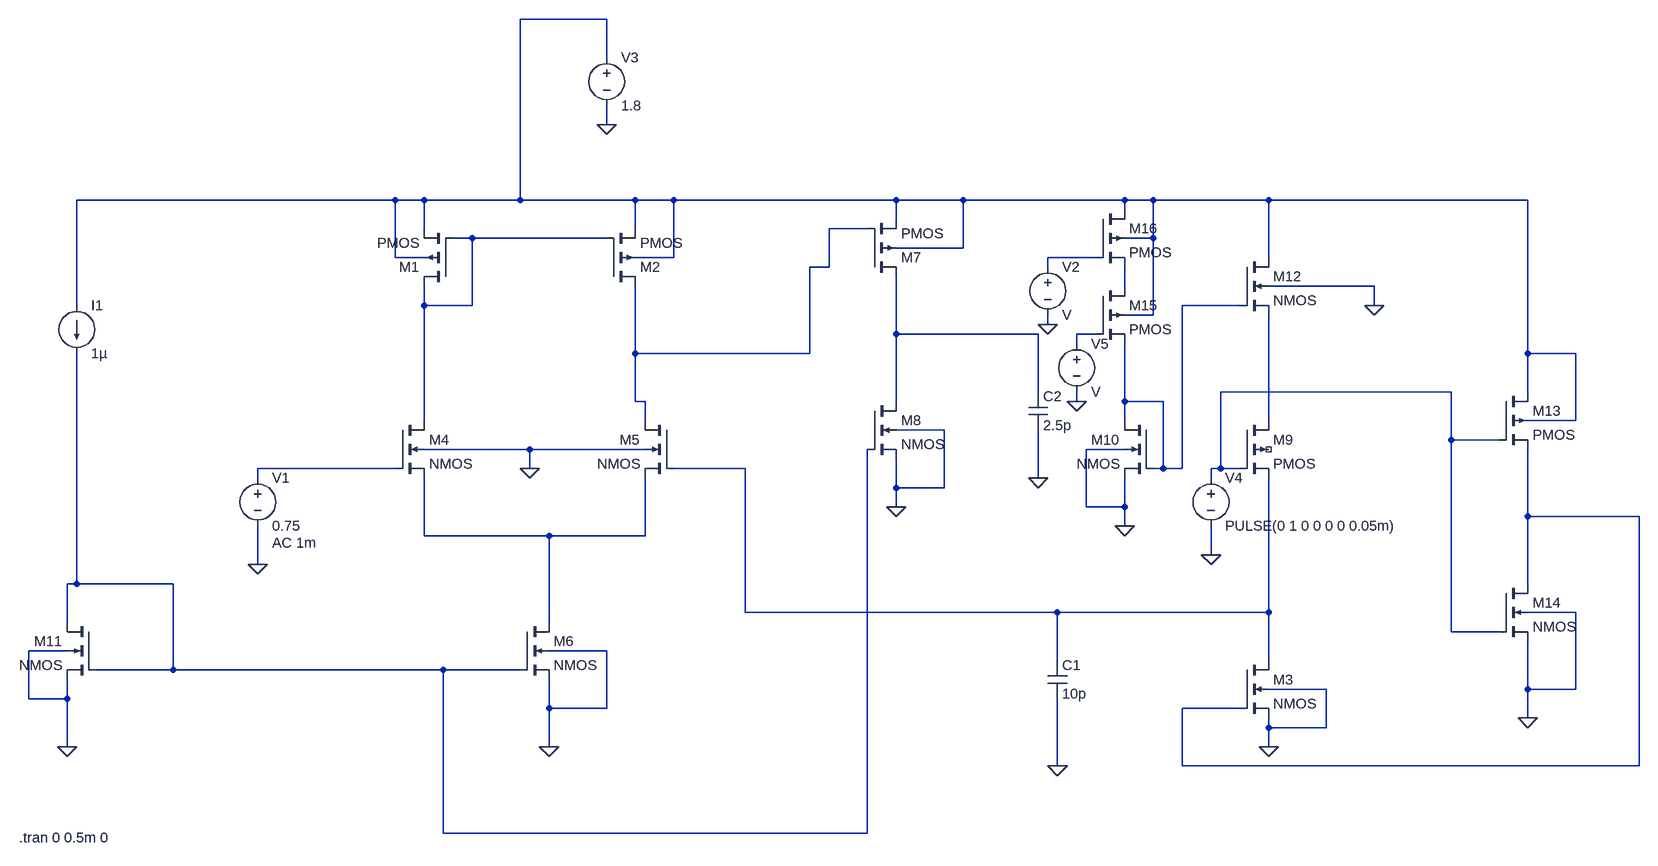
[diagram p0: schematic comp.asc]
comp.asc, the LTspice schematic file:
Version 4
SHEET 1 3156 680
WIRE 1088 -768 944 -768
WIRE 1088 -704 1088 -768
WIRE 1088 -592 1088 -624
WIRE 496 -400 -400 -400
WIRE 736 -400 496 -400
WIRE 784 -400 736 -400
WIRE 944 -400 944 -768
WIRE 944 -400 784 -400
WIRE 1136 -400 944 -400
WIRE 1200 -400 1136 -400
WIRE 1360 -400 1200 -400
WIRE 1664 -400 1360 -400
WIRE 1776 -400 1664 -400
WIRE 2048 -400 1776 -400
WIRE 2096 -400 2048 -400
WIRE 2288 -400 2096 -400
WIRE 2720 -400 2288 -400
WIRE 2048 -384 2048 -400
WIRE 1664 -368 1664 -400
WIRE 784 -352 784 -400
WIRE 1136 -352 1136 -400
WIRE 1616 -352 1552 -352
WIRE 864 -336 832 -336
WIRE 1024 -336 864 -336
WIRE 1088 -336 1024 -336
WIRE 2096 -336 2096 -400
WIRE 2096 -336 2048 -336
WIRE 1776 -320 1776 -400
WIRE 1776 -320 1664 -320
WIRE 736 -304 736 -400
WIRE 784 -304 736 -304
WIRE 1200 -304 1200 -400
WIRE 1200 -304 1136 -304
WIRE 2000 -304 1920 -304
WIRE 2288 -304 2288 -400
WIRE 1552 -288 1552 -352
WIRE 1552 -288 1520 -288
WIRE 1920 -288 1920 -304
WIRE 2048 -256 2048 -288
WIRE 2464 -256 2288 -256
WIRE -400 -224 -400 -400
WIRE 784 -224 784 -256
WIRE 864 -224 864 -336
WIRE 864 -224 784 -224
WIRE 2240 -224 2144 -224
WIRE 2464 -224 2464 -256
WIRE 1664 -208 1664 -272
WIRE 2096 -208 2096 -336
WIRE 2096 -208 2048 -208
WIRE 2720 -208 2720 -400
WIRE 1136 -192 1136 -256
WIRE 1920 -192 1920 -208
WIRE 1664 -176 1664 -208
WIRE 1904 -176 1664 -176
WIRE 2000 -176 1968 -176
WIRE 1968 -160 1968 -176
WIRE 1136 -144 1136 -192
WIRE 1312 -144 1136 -144
WIRE 1520 -144 1520 -288
WIRE 1520 -144 1312 -144
WIRE 2720 -144 2720 -208
WIRE 2800 -144 2720 -144
WIRE 784 -96 784 -224
WIRE 2144 -96 2144 -224
WIRE 1904 -80 1904 -176
WIRE 2400 -80 2208 -80
WIRE 2592 -80 2400 -80
WIRE 2720 -80 2720 -144
WIRE 1136 -64 1136 -144
WIRE 1152 -64 1136 -64
WIRE 1664 -64 1664 -176
WIRE 1968 -64 1968 -80
WIRE 2048 -64 2048 -160
WIRE 2112 -64 2048 -64
WIRE 784 -32 784 -96
WIRE 1152 -32 1152 -64
WIRE 2048 -32 2048 -64
WIRE 2288 -32 2288 -208
WIRE 2800 -32 2800 -144
WIRE 2800 -32 2720 -32
WIRE 1744 -16 1664 -16
WIRE 2592 0 2592 -80
WIRE 2672 0 2592 0
WIRE 960 16 784 16
WIRE 1152 16 960 16
WIRE 2048 16 1984 16
WIRE 736 48 480 48
WIRE 960 48 960 16
WIRE 1360 48 1200 48
WIRE 1376 48 1360 48
WIRE 2112 48 2112 -64
WIRE 2112 48 2096 48
WIRE 2144 48 2144 -96
WIRE 2144 48 2112 48
WIRE 2208 48 2208 -80
WIRE 2208 48 2192 48
WIRE 2240 48 2208 48
WIRE 480 64 480 48
WIRE 1904 64 1904 -16
WIRE 2192 64 2192 48
WIRE 1664 80 1664 32
WIRE 1744 80 1744 -16
WIRE 1744 80 1664 80
WIRE 1664 112 1664 80
WIRE 1984 112 1984 16
WIRE 2048 112 2048 64
WIRE 2048 112 1984 112
WIRE 2720 128 2720 16
WIRE 2784 128 2720 128
WIRE 3152 128 2784 128
WIRE 2048 144 2048 112
WIRE 784 160 784 64
WIRE 880 160 784 160
WIRE 992 160 880 160
WIRE 1152 160 1152 64
WIRE 1152 160 992 160
WIRE 2192 192 2192 144
WIRE 480 208 480 144
WIRE 1616 224 1616 16
WIRE -400 240 -400 -144
WIRE -400 240 -416 240
WIRE -224 240 -400 240
WIRE 2720 240 2720 128
WIRE 1376 288 1376 48
WIRE 1776 288 1376 288
WIRE 1936 288 1776 288
WIRE 2112 288 1936 288
WIRE 2288 288 2288 64
WIRE 2288 288 2112 288
WIRE 2800 288 2720 288
WIRE -416 304 -416 240
WIRE 992 304 992 160
WIRE 2592 320 2592 0
WIRE 2672 320 2592 320
WIRE -416 352 -480 352
WIRE 1088 352 992 352
WIRE 1936 368 1936 288
WIRE 2288 368 2288 288
WIRE -224 384 -224 240
WIRE -224 384 -368 384
WIRE 816 384 -224 384
WIRE 944 384 816 384
WIRE 2384 416 2288 416
WIRE 2720 416 2720 336
WIRE 2800 416 2800 288
WIRE 2800 416 2720 416
WIRE -480 432 -480 352
WIRE -416 432 -416 400
WIRE -416 432 -480 432
WIRE 992 448 992 400
WIRE 1088 448 1088 352
WIRE 1088 448 992 448
WIRE 2240 448 2144 448
WIRE 2720 464 2720 416
WIRE 2288 480 2288 464
WIRE 2384 480 2384 416
WIRE 2384 480 2288 480
WIRE -416 512 -416 432
WIRE 992 512 992 448
WIRE 2288 512 2288 480
WIRE 1936 544 1936 432
WIRE 2144 544 2144 448
WIRE 3152 544 3152 128
WIRE 3152 544 2144 544
WIRE 816 656 816 384
WIRE 1616 656 1616 224
WIRE 1616 656 816 656
FLAG 1088 -592 0
FLAG 960 48 0
FLAG 992 512 0
FLAG 1664 112 0
FLAG 1904 64 0
FLAG -416 512 0
FLAG 1936 544 0
FLAG 2288 512 0
FLAG 2464 -224 0
FLAG 2048 144 0
FLAG 2192 192 0
FLAG 2720 464 0
FLAG 480 208 0
FLAG 1920 -192 0
FLAG 1968 -64 0
DATAFLAG 496 -400 ""
DATAFLAG 1360 -400 ""
DATAFLAG 784 -96 ""
DATAFLAG 1136 -192 ""
DATAFLAG 1664 -208 ""
DATAFLAG 1616 224 ""
DATAFLAG 880 160 ""
DATAFLAG 1024 -336 ""
DATAFLAG 1360 48 ""
DATAFLAG 1312 -144 ""
DATAFLAG 2400 -80 ""
DATAFLAG 2784 128 ""
DATAFLAG 2720 -208 ""
DATAFLAG 2144 -96 ""
DATAFLAG 2112 288 ""
DATAFLAG 1776 288 ""
SYMBOL nmos4 736 -32 R0
SYMATTR InstName M4
SYMATTR Value2 l=1u w=20u
SYMBOL nmos4 1200 -32 M0
SYMATTR InstName M5
SYMATTR Value2 l=1u w=20u
SYMBOL nmos4 944 304 R0
SYMATTR InstName M6
SYMATTR Value2 l=2u w=20u
SYMBOL voltage 1088 -720 R0
WINDOW 123 0 0 Left 2
WINDOW 39 0 0 Left 2
SYMATTR InstName V3
SYMATTR Value 1.8
SYMBOL nmos4 1616 -64 R0
SYMATTR InstName M8
SYMATTR Value2 l=2u w=20u
SYMBOL cap 1888 -80 R0
SYMATTR InstName C2
SYMATTR Value 2.5p
SYMBOL nmos4 -368 304 M0
SYMATTR InstName M11
SYMATTR Value2 l=2u w=20u
SYMBOL current -400 -224 R0
WINDOW 123 0 0 Left 2
WINDOW 39 0 0 Left 2
SYMATTR InstName I1
SYMATTR Value 1µ
SYMBOL voltage 480 48 R0
WINDOW 123 24 124 Left 2
WINDOW 39 0 0 Left 2
SYMATTR Value2 AC 1m
SYMATTR InstName V1
SYMATTR Value 0.75
SYMBOL pmos4 832 -256 R180
SYMATTR InstName M1
SYMATTR Value2 l=5u w=20u
SYMBOL pmos4 1088 -256 M180
SYMATTR InstName M2
SYMATTR Value2 l=5u w=20u
SYMBOL pmos4 1616 -272 M180
SYMATTR InstName M7
SYMATTR Value2 l=5u w=20u
SYMBOL cap 1920 368 R0
SYMATTR InstName C1
SYMATTR Value 10p
SYMBOL nmos4 2240 368 R0
SYMATTR InstName M3
SYMATTR Value2 l=5u w=10u
SYMBOL pmos4 2240 -32 R0
SYMATTR InstName M9
SYMATTR Value2 l=2u w=10u
SYMBOL nmos4 2096 -32 M0
SYMATTR InstName M10
SYMATTR Value2 l=2u w=20u
SYMBOL nmos4 2240 -304 R0
SYMATTR InstName M12
SYMATTR Value2 l=5u w=20u
SYMBOL voltage 2192 48 R0
WINDOW 123 0 0 Left 2
WINDOW 39 0 0 Left 2
SYMATTR InstName V4
SYMATTR Value PULSE(0 1 0 0 0 0 0.05m)
SYMBOL pmos4 2672 -80 R0
SYMATTR InstName M13
SYMATTR Value2 l=5u w=10u
SYMBOL nmos4 2672 240 R0
SYMATTR InstName M14
SYMATTR Value2 l=5u w=10u
SYMBOL pmos4 2000 -256 R0
SYMATTR InstName M15
SYMBOL pmos4 2000 -384 R0
SYMATTR InstName M16
SYMBOL voltage 1920 -304 R0
SYMATTR InstName V2
SYMBOL voltage 1968 -176 R0
SYMATTR InstName V5
TEXT -496 664 Left 2 !.tran 0 0.5m 0

The netlist it stands for:
* comp.asc
M4 N003 N011 N014 0 NMOS l=1u w=20u
M5 N002 N012 N014 0 NMOS l=1u w=20u
M6 N014 N015 0 0 NMOS l=2u w=20u
V3 N001 0 1.8
M8 N007 N015 0 0 NMOS l=2u w=20u
C2 N007 0 2.5p
M11 N015 N015 0 0 NMOS l=2u w=20u
I1 N001 N015 1µ
V1 N011 0 0.75 AC 1m
M1 N003 N003 N001 N001 PMOS l=5u w=20u
M2 N002 N003 N001 N001 PMOS l=5u w=20u
M7 N007 N002 N001 N001 PMOS l=5u w=20u
C1 N012 0 10p
M3 N012 N013 0 0 NMOS l=5u w=10u
M9 N010 N009 N012 NC_01 PMOS l=2u w=10u
M10 N006 N006 0 0 NMOS l=2u w=20u
M12 N001 N006 N010 0 NMOS l=5u w=20u
V4 N009 0 PULSE(0 1 0 0 0 0 0.05m)
M13 N001 N009 N013 N001 PMOS l=5u w=10u
M14 N013 N009 0 0 NMOS l=5u w=10u
M15 N005 N008 N006 N001 PMOS
M16 N001 N004 N005 N001 PMOS
V2 N004 0 V
V5 N008 0 V
.model NMOS NMOS
.model PMOS PMOS
.lib standard.mos
.tran 0 0.5m 0
.backanno
.end